# EAGLE design lipo-shutoff (EAGLE 7.1.0)
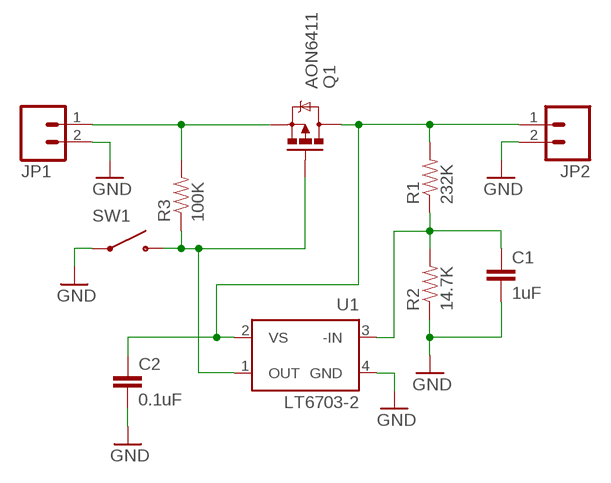
[diagram p0: schematic, sheet 1]

## Parts
C1  1uF  CAP0603-CAP  [0603-CAP]
C2  0.1uF  CAP0603-CAP  [0603-CAP]
JP1  M02LOCK_LONGPADS  [1X02_LOCK_LONGPADS]
JP2  M02LOCK_LONGPADS  [1X02_LOCK_LONGPADS]
Q1  AON6411  [DFN5X6]
R1  232K  RESISTOR0603-RES  [0603-RES]
R2  14.7K  RESISTOR0603-RES  [0603-RES]
R3  100K  RESISTOR0603-RES  [0603-RES]
SW1  FSM4JSMA  [FSM4JSMA]
U1  LT6703-2  [LT6703]

## Nets
GND: C1.2 C2.2 JP1.2 JP2.2 R2.1 SW1.1 SW1.2 U1.4(GND)
N$1: JP1.1 Q1.1(S) Q1.2(S) Q1.3(S) R3.2
N$3: Q1.4(G) R3.1 SW1.3 SW1.4 U1.1(OUT)
N$4: C2.1 JP2.1 Q1.5(D) Q1.6(D) Q1.7(D) Q1.8(D) Q1.PAD(D) R1.2 U1.2(VS)
N$5: C1.1 R1.1 R2.2 U1.3(-IN)

## Library data of the parts
C1 C2 = SparkFun-Passives:CAP: Capacitor Standard 0603 ceramic capacitor, and 0.1" leaded capacitor.
JP1 JP2 = SparkFun-Connectors:M02: Standard 2-pin 0.1" header. Use with - straight break away headers ( PRT-00116) - right angle break away headers (PRT-00553) - swiss pins (PRT-00743) - machine pins (PRT-00117) - female headers (PRT-00115) Molex polarized connector foot print use with: PRT-08233 with associated crimp pins and housings. 2.54_SCREWTERM for use with PRT-10571. 3.5mm Screw Terminal footprints for PRT-08084 5mm Screw Terminal footprints for use with PRT-08432
Q1 = Custom:AON6411
R1-R3 = SparkFun-Passives:RESISTOR: Resistor Basic schematic elements and footprints for 0603, 1206, and PTH resistors.
SW1 = Custom:FSM4JSMA
U1 = Custom:LT6703-2

## Board
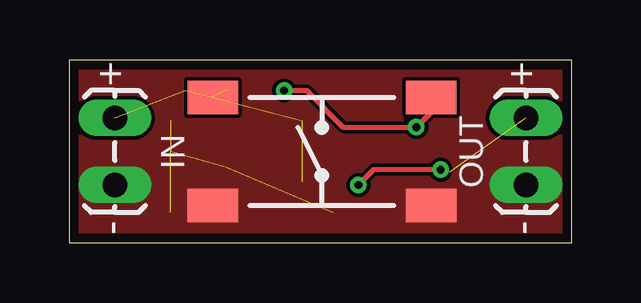
[diagram p1: board, top side]
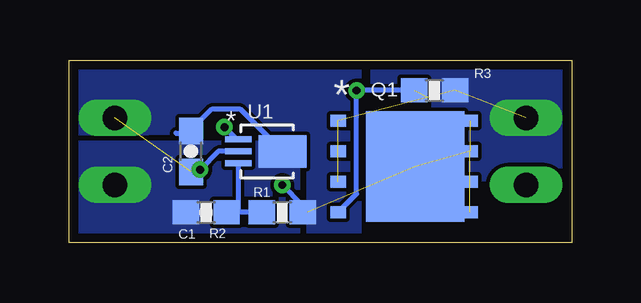
[diagram p2: board, bottom side, seen from below]

Size 20.95 x 7.62 mm. Coordinates in mm from the lower left corner, seen from the top.
Outline: 0,0 20.95,0 20.95,7.62 0,7.62 0,0
Copper layers (1*16): Top 0.0356mm / dielectric 1.5011mm / Bottom 0.0356mm
Design rules "LaenPCBOrder *": minimum track width 6mil, minimum drill 13mil, track to track 6mil, track to pad 6mil, pad to pad 6mil, via to via 6mil, smd to smd 6mil, copper to edge 15mil, drill to drill 6mil, minimum pad ring 7mil, minimum via ring 7mil, stop-mask expansion 3mil, vias tented up to drill 0mil, thermal gap 6mil

### Footprints (pad centres in the part's own frame; a part is rotated, then mirrored left to right if it is on the bottom)
0603-CAP = smd 1.1 x 1: 1 -0.85,0; 2 0.85,0
1X02_LOCK_LONGPADS = drill 1.016 long: 1 -0.127,0; 2 2.667,0
DFN5X6 = smd 0.5 x 0.65: 1 -1.905,-2.75; 2 -0.635,-2.75; 3 0.635,-2.75; 4 1.905,-2.75; 5 1.905,2.75; 6 0.635,2.75; 7 -0.635,2.75; 8 -1.905,2.75 | smd 4.6 x 4.12: PAD 0,0.46
0603-RES = smd 1.1 x 1: 1 -0.85,0; 2 0.85,0
FSM4JSMA = smd 1.4 x 2.1: 1 -2.25,4.55; 2 -2.25,-4.55; 3 2.25,4.55; 4 2.25,-4.55
LT6703 = smd 0.25 x 1.1: 1 -0.5,-1.2; 2 0,-1.2; 3 0.5,-1.2 | smd 1.35 x 2: 4 0,0.65

### Placement (x,y rotation side)
C1  15.24,1.27 180 bottom
C2  15.88,3.81 90 bottom
JP1  1.91,5.08 270 top
JP2  19.05,5.08 270 top
Q1  6.99,3.17 270 bottom
R1  12.06,1.27 0 bottom
R2  15.24,1.27 0 bottom
R3  5.71,6.35 0 bottom
SW1  10.54,3.81 90 top
U1  12.7,3.81 270 bottom

### Tracks (layer width: path | path; a pad name or v marks a point on that pad's centre or on a via)
GND
  Bottom 0.203: U1.4 13.83,5.59 14.99,5.59 15.88,4.7 C2.2 15.96,4.57 16.51,4.57
  pour Bottom (no thermals): 11.43,0 11.43,4.13 20.95,4.13 20.95,0
  pour Top (no thermals): 0,0 20.95,0 20.95,7.62 0,7.62
N$1  (4 unrouted)
  pour Bottom (no thermals): 0,7.62 0,0 8.26,0 8.26,7.62
N$3  (via drill 0.33)  (1 unrouted)
  Top 0.203: v8.97,6.35 9.91,6.35 11.43,4.83 v14.48,4.83 15.71,6.06 SW1.4
  Bottom 0.203: R3.1 v8.97,6.35 8.97,2.04 Q1.4 | v14.48,4.83 13.96,4.31 U1.1
N$4  (via drill 0.33)  (6 unrouted)
  Top 0.203: v15.49,3.05 12.7,3.05 v12.06,2.41
  Bottom 0.203: 11.01,1.27 R1.2 11.21,1.56 v12.06,2.41 | C2.1 15.58,2.96 v15.49,3.05 14.73,3.81 U1.2
  pour Bottom (no thermals): 8.89,0 10.92,0 10.92,4.62 21.02,4.57 20.95,7.62 8.89,7.62
N$5
  Bottom 0.203: R1.1 13.97,1.27 | 13.72,3.31 U1.3 13.9,1.34 13.97,1.27 | 13.97,1.27 C1.1

### Text on the board
tPlace: + | + | IN | OUT | - | -